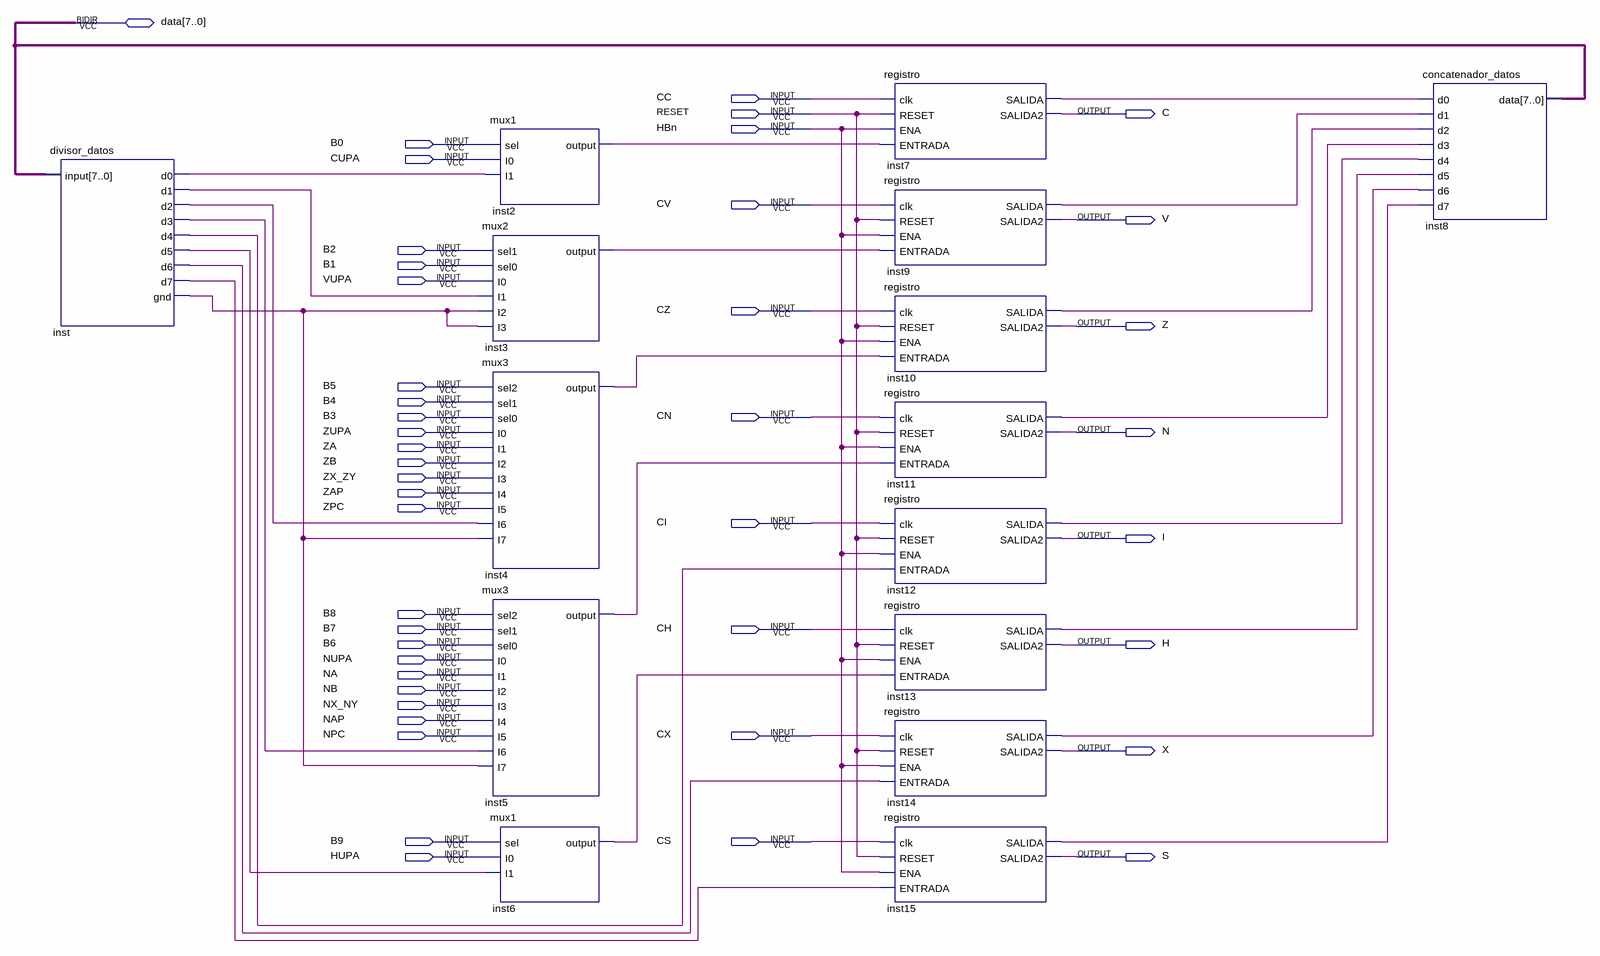
[diagram p0: schematic sheet]
// Quartus schematic RegistroEstados.bdf as structural Verilog: 15 symbols, 44 pins
module RegistroEstados (
  input  CC,
  input  RESET,
  input  HBn,
  input  B0,
  input  CUPA,
  input  CV,
  input  B2,
  input  B1,
  input  VUPA,
  input  CZ,
  input  B5,
  input  B4,
  input  B3,
  input  CN,
  input  ZUPA,
  input  ZA,
  input  ZB,
  input  ZX_ZY,
  input  ZAP,
  input  ZPC,
  input  CI,
  input  B8,
  input  B7,
  input  CH,
  input  B6,
  input  NUPA,
  input  NA,
  input  NB,
  input  NX_NY,
  input  NAP,
  input  NPC,
  input  CX,
  input  B9,
  input  CS,
  input  HUPA,
  inout  [7:0] data,
  output C,
  output V,
  output Z,
  output N,
  output I,
  output H,
  output X,
  output S
);

  wire inst2_output, inst3_output, inst4_output, inst5_output, inst6_output, inst7_salida, inst9_salida,
       inst10_salida, inst11_salida, inst12_salida, inst13_salida, inst14_salida, inst15_salida, inst_d0,
       inst_d1, inst_d2, inst_d3, inst_d4, inst_d5, inst_d6, inst_d7, inst_gnd;

  divisor_datos inst (
    .\input (data), .d0(inst_d0), .d1(inst_d1), .d2(inst_d2), .d3(inst_d3), .d4(inst_d4), .d5(inst_d5),
    .d6(inst_d6), .d7(inst_d7), .gnd(inst_gnd));
  mux1 inst2 (.sel(B0), .I0(CUPA), .I1(inst_d0), .\output (inst2_output));
  mux2 inst3 (.sel1(B2), .sel0(B1), .I0(VUPA), .I1(inst_d1), .I2(inst_gnd), .I3(inst_gnd), .\output (inst3_output));
  mux3 inst4 (
    .sel2(B5), .sel1(B4), .sel0(B3), .I0(ZUPA), .I1(ZA), .I2(ZB), .I3(ZX_ZY), .I4(ZAP), .I5(ZPC),
    .I6(inst_d2), .I7(inst_gnd), .\output (inst4_output));
  mux3 inst5 (
    .sel2(B8), .sel1(B7), .sel0(B6), .I0(NUPA), .I1(NA), .I2(NB), .I3(NX_NY), .I4(NAP), .I5(NPC),
    .I6(inst_d3), .I7(inst_gnd), .\output (inst5_output));
  mux1 inst6 (.sel(B9), .I0(HUPA), .I1(inst_d5), .\output (inst6_output));
  registro inst7 (.clk(CC), .RESET(RESET), .ENA(HBn), .ENTRADA(inst2_output), .SALIDA(inst7_salida), .SALIDA2(C));
  registro inst9 (.clk(CV), .RESET(RESET), .ENA(HBn), .ENTRADA(inst3_output), .SALIDA(inst9_salida), .SALIDA2(V));
  registro inst10 (.clk(CZ), .RESET(RESET), .ENA(HBn), .ENTRADA(inst4_output), .SALIDA(inst10_salida), .SALIDA2(Z));
  registro inst11 (.clk(CN), .RESET(RESET), .ENA(HBn), .ENTRADA(inst5_output), .SALIDA(inst11_salida), .SALIDA2(N));
  registro inst12 (.clk(CI), .RESET(RESET), .ENA(HBn), .ENTRADA(inst_d4), .SALIDA(inst12_salida), .SALIDA2(I));
  registro inst13 (.clk(CH), .RESET(RESET), .ENA(HBn), .ENTRADA(inst6_output), .SALIDA(inst13_salida), .SALIDA2(H));
  registro inst14 (.clk(CX), .RESET(RESET), .ENA(HBn), .ENTRADA(inst_d6), .SALIDA(inst14_salida), .SALIDA2(X));
  registro inst15 (.clk(CS), .RESET(RESET), .ENA(HBn), .ENTRADA(inst_d7), .SALIDA(inst15_salida), .SALIDA2(S));
  concatenador_datos inst8 (
    .d0(inst7_salida), .d1(inst9_salida), .d2(inst10_salida), .d3(inst11_salida), .d4(inst12_salida),
    .d5(inst13_salida), .d6(inst14_salida), .d7(inst15_salida), .data(data));
endmodule
